# Altium project RpiPaw1.PrjPCB
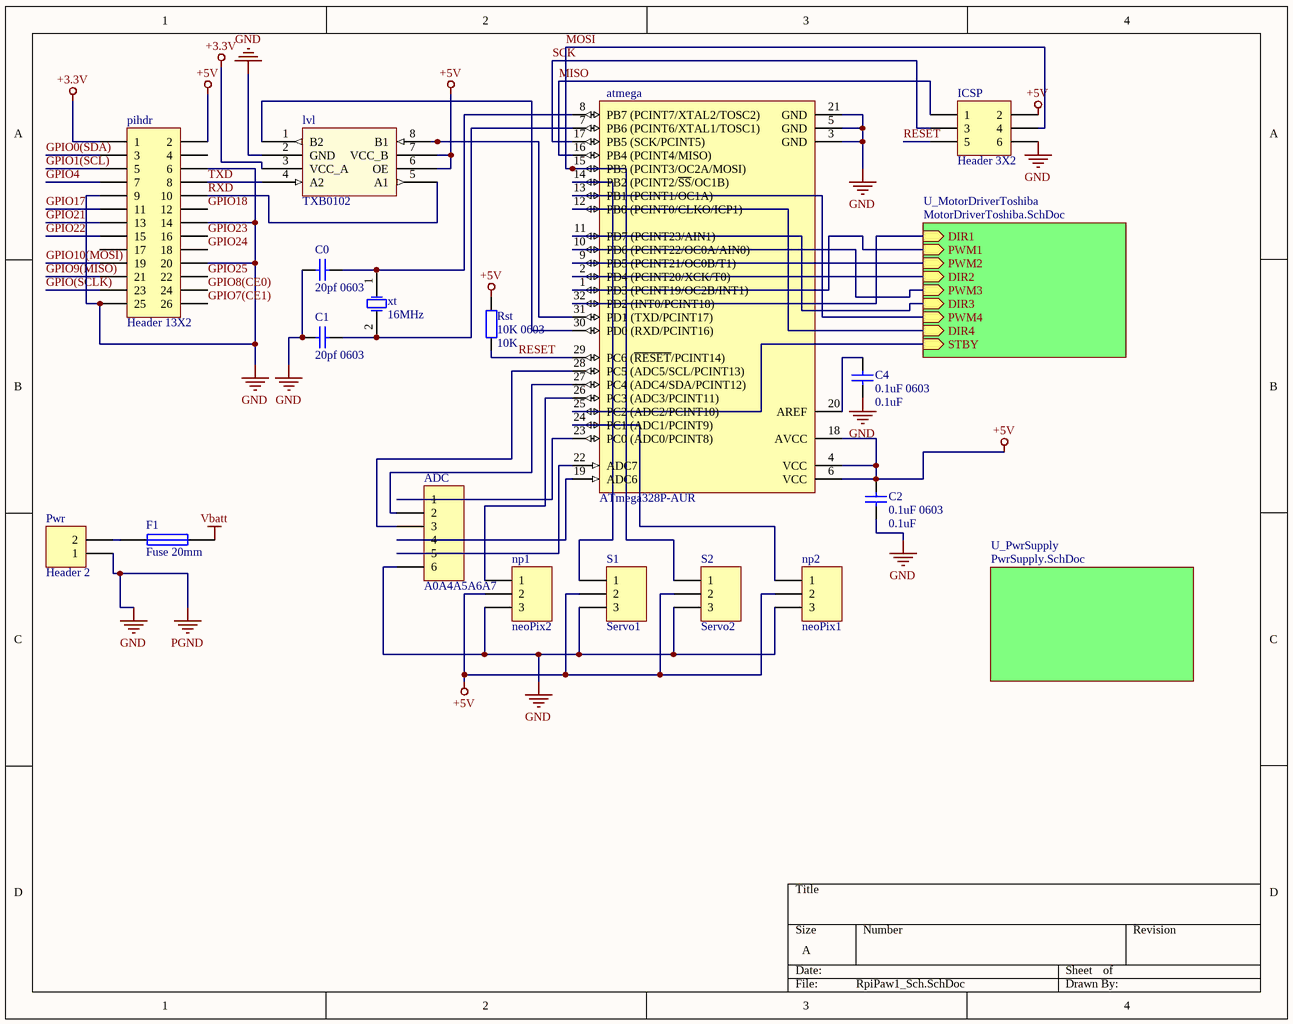
[diagram p0: RpiPaw1_Sch.SchDoc]
3 sheets, 39 parts. Net scope: hierarchical (ports join the sheet entries above them; power ports are global).
Board files: paw8.PcbDoc, Paw3.PcbDoc, Paw2.PcbDoc
Sheets:
  RpiPaw1_Sch.SchDoc
    U_MotorDriverToshiba = MotorDriverToshiba.SchDoc
    U_PwrSupply = PwrSupply.SchDoc

## Sheet RpiPaw1_Sch.SchDoc
size A

### Parts
ADC  A0A4A5A6A7  [HDR1X6]
atmega  ATmega328P-AUR  [TQFP32_N]
C0  20pf 0603  [J1-0603]
C1  20pf 0603  [J1-0603]
C2  0.1uF 0603  value 0.1uF  [J1-0603]
C4  0.1uF 0603  value 0.1uF  [J1-0603]
F1  Fuse 20mm  [FusePad1]
ICSP  Header 3X2  [HDR2X3]
lvl  TXB0102  [TSSOP50P310X90-8N]
np1  neoPix2  [HDR1X3]
np2  neoPix1  [HDR1X3]
pihdr  Header 13X2  [HDR2X13]
Pwr  Header 2  [PwrPlug1]
Rst  10K 0603  value 10K  [J1-0603]
S1  Servo1  [HDR1X3]
S2  Servo2  [HDR1X3]
xt  16MHz  [Axial 0.2]

### Sub-sheets
U_MotorDriverToshiba = MotorDriverToshiba.SchDoc: DIR1 (in), PWM1 (in), PWM2 (in), DIR2 (in), PWM3 (in), DIR3 (in), PWM4 (in), DIR4 (in), STBY (in)
U_PwrSupply = PwrSupply.SchDoc: no entries

### Nets
+3.3V: lvl.3(VCC_A) pihdr.1
+5V: atmega.4(VCC) atmega.6(VCC) atmega.18(AVCC) C2.2 ICSP.2 lvl.6(OE) lvl.7(VCC_B) np1.2 np2.2 pihdr.2 Rst.2 S1.2 S2.2
GND: ADC.6 atmega.3(GND) atmega.5(GND) atmega.21(GND) C0.1 C1.1 C2.1 C4.1 ICSP.6 lvl.2(GND) np1.3 np2.3 pihdr.6 pihdr.9 pihdr.14 pihdr.20 pihdr.25 Pwr.1 S1.3 S2.3  [also labelled PGND]
Vbatt: F1.2
GPIO0(SDA): pihdr.3
GPIO1(SCL): pihdr.5
GPIO4: pihdr.7
GPIO7(CE1): pihdr.26
GPIO8(CE0): pihdr.24
GPIO9(MISO): pihdr.21
GPIO10(MOSI): pihdr.19
GPIO17: pihdr.11
GPIO18: pihdr.12
GPIO21: pihdr.13
GPIO22: pihdr.15
GPIO23: pihdr.16
GPIO24: pihdr.18
GPIO25: pihdr.22
GPIO(SCLK): pihdr.23
MISO: atmega.16(PB4_(PCINT4/MISO)) ICSP.1
MOSI: atmega.15(PB3_(PCINT3/OC2A/MOSI)) ICSP.4 S2.1
RESET: atmega.29(PC6_(~{RESET}/PCINT14)) ICSP.5 Rst.1
RXD: lvl.5(A1) pihdr.10
SCK: atmega.17(PB5_(SCK/PCINT5)) ICSP.3
TXD: lvl.4(A2) pihdr.8
NetADC_1: ADC.1 atmega.23(PC0_(ADC0/PCINT8))
NetADC_2: ADC.2 atmega.27(PC4_(ADC4/SDA/PCINT12))
NetADC_3: ADC.3 atmega.28(PC5_(ADC5/SCL/PCINT13))
NetADC_4: ADC.4 atmega.19(ADC6)
NetADC_5: ADC.5 atmega.22(ADC7)
Netatmega_1: atmega.1(PD3_(PCINT19/OC2B/INT1)) ; sheet U_MotorDriverToshiba/PWM1
Netatmega_2: atmega.2(PD4_(PCINT20/XCK/T0)) ; sheet U_MotorDriverToshiba/DIR2
Netatmega_7: atmega.7(PB6_(PCINT6/XTAL1/TOSC1)) C1.2 xt.2(OSC2)
Netatmega_8: atmega.8(PB7_(PCINT7/XTAL2/TOSC2)) C0.2 xt.1(OSC1)
Netatmega_9: atmega.9(PD5_(PCINT21/OC0B/T1)) ; sheet U_MotorDriverToshiba/PWM2
Netatmega_10: atmega.10(PD6_(PCINT22/OC0A/AIN0)) ; sheet U_MotorDriverToshiba/PWM3
Netatmega_11: atmega.11(PD7_(PCINT23/AIN1)) ; sheet U_MotorDriverToshiba/DIR3
Netatmega_12: atmega.12(PB0_(PCINT0/CLKO/ICP1)) ; sheet U_MotorDriverToshiba/DIR4
Netatmega_13: atmega.13(PB1_(PCINT1/OC1A)) ; sheet U_MotorDriverToshiba/PWM4
Netatmega_14: atmega.14(PB2_(PCINT2/~{SS}/OC1B)) S1.1
Netatmega_20: atmega.20(AREF) C4.2
Netatmega_24: atmega.24(PC1_(ADC1/PCINT9)) np2.1
Netatmega_25: atmega.25(PC2_(ADC2/PCINT10)) ; sheet U_MotorDriverToshiba/STBY
Netatmega_26: atmega.26(PC3_(ADC3/PCINT11)) np1.1
Netatmega_30: atmega.30(PD0_(RXD/PCINT16)) lvl.1(B2)
Netatmega_31: atmega.31(PD1_(TXD/PCINT17)) lvl.8(B1)
Netatmega_32: atmega.32(PD2_(INT0/PCINT18)) ; sheet U_MotorDriverToshiba/DIR1
NetF1_1: F1.1 Pwr.2

Not connected (* = marked no-connect by the designer): pihdr 4 17

### Library data of the parts
ADC = Header 6: Header, 6-Pin; LatestRevisionDate: 17-Jul-2002; LatestRevisionNote: Re-released for DXP Platform.; Publisher: Altium Limited
atmega = ATmega328P-AUR: 8-bit AVR Microcontroller, 32KB Flash, 1KB EEPROM, 2KB SRAM, 32-pin TQFP, Industrial Grade (-40°C to 85°C); Published: 1-Apr-2010; DatasheetVersion: revA, Jan-2010; PackageVersion: revB, Oct-2001; PackageReference: 32A; Publisher: Altium Limited; PackageDescription: 32-Lead, 7x7x1.0 mm Body, 0.8mm Lead Pitch, Thin Profile Plastic Quad Flat Package (TQFP); Supplier 1: Digi-Key; Supplier Part Number 1: ATMEGA328P-AUR-ND; Supplier 2: Mouser; Supplier Part Number 2: 556-ATMEGA328P-AUR; Code_JEDEC: MS-026-ABA; ComponentLink1Description: Manufacturer Link; ComponentLink1URL: http://www.atmel.com/products/avr/default.asp?; ComponentLink2Description: ATmega48A/48PA/88A/88PA/168A/168PA/328/328P Datasheet; ComponentLink2URL: http://www.atmel.com/dyn/resources/prod_documents/8271.pdf; ComponentLink3Description: ATmega48A/48PA/88A/88PA/168A/168PA/328/328P Summary; ComponentLink3URL: http://www.atmel.com/dyn/resources/prod_documents/8271S.pdf; ComponentLink4Description: Atmel.com Home; ComponentLink4URL: http://www.atmel.com
C0-C2 C4 = Cap: Capacitor; Published: 8-Jun-2000; LatestRevisionDate: 17-Jul-2002; LatestRevisionNote: Re-released for DXP Platform.; PackageReference: RAD-0.3; Publisher: Altium Limited
F1 = Fuse 1: Fuse; Published: 8-Jun-2000; LatestRevisionDate: 17-Jul-2002; LatestRevisionNote: Re-released for DXP Platform.; PackageReference: PIN-W2/E2.8; Publisher: Altium Limited
ICSP = Header 3X2: Header, 3-Pin, Dual row; LatestRevisionDate: 17-Jul-2002; LatestRevisionNote: Re-released for DXP Platform.; Publisher: Altium Limited
lvl = TXB0102: 3.3V Level translator
np1 np2 S1 S2 = Header 3: Header, 3-Pin; LatestRevisionDate: 17-Jul-2002; LatestRevisionNote: Re-released for DXP Platform.; Publisher: Altium Limited
pihdr = Header 13X2: Header, 13-Pin, Dual row; LatestRevisionDate: 17-Jul-2002; LatestRevisionNote: Re-released for DXP Platform.; Publisher: Altium Limited
Pwr = Header 2: Header, 2-Pin; LatestRevisionDate: 17-Jul-2002; LatestRevisionNote: Re-released for DXP Platform.; Publisher: Altium Limited
Rst = Res2: Resistor; Published: 8-Jun-2000; LatestRevisionDate: 17-Jul-2002; LatestRevisionNote: Re-released for DXP Platform.; PackageReference: AXIAL-0.4; Publisher: Altium Limited
xt = XTAL: Crystal Oscillator; Published: 8-Jun-2000; LatestRevisionDate: 17-Jul-2002; LatestRevisionNote: Re-released for DXP Platform.; PackageReference: R38; Publisher: Altium Limited

## Sheet MotorDriverToshiba.SchDoc
size A
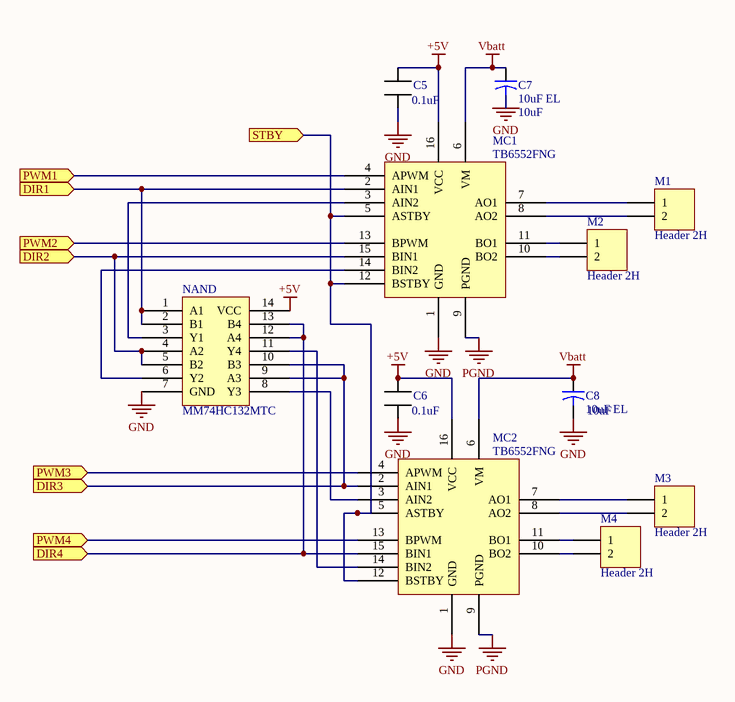
[diagram p1: MotorDriverToshiba.SchDoc]

### Parts
C5  value 0.1uF  [J1-0603]  (hidden comment: 0.1uF 0603)
C6  value 0.1uF  [J1-0603]  (hidden comment: 0.1uF 0603)
C7  10uF EL  value 10uF  [CAPR5-4X5]
C8  10uF EL  value 10uF  [CAPR5-4X5]
M1  Header 2H  [HDR1X2H]
M2  Header 2H  [HDR1X2H]
M3  Header 2H  [HDR1X2H]
M4  Header 2H  [HDR1X2H]
MC1  TB6552FNG  [SSOP16]
MC2  TB6552FNG  [SSOP16]
NAND  MM74HC132MTC  [TSSOP14]

### Ports
DIR1 (in), DIR2 (in), DIR3 (in), DIR4 (in), PWM1 (in), PWM2 (in), PWM3 (in), PWM4 (in), STBY (in)

### Nets
+5V: C5.2(P2) C6.2(P2) MC1.16(VCC) MC2.16(VCC) NAND.14(VCC)
GND: C5.1(P1) C6.1(P1) C7.2 C8.2 MC1.1(GND) MC1.9(PGND) MC2.1(GND) MC2.9(PGND) NAND.7(GND)  [also labelled PGND]
Vbatt: C7.1 C8.1 MC1.6(VM) MC2.6(VM)
Netatmega_1: MC1.4(APWM) ; port PWM1
Netatmega_2: MC1.15(BIN1) NAND.4(A2) NAND.5(B2) ; port DIR2
Netatmega_9: MC1.13(BPWM) ; port PWM2
Netatmega_10: MC2.4(APWM) ; port PWM3
Netatmega_11: MC2.2(AIN1) NAND.9(A3) NAND.10(B3) ; port DIR3
Netatmega_12: MC2.15(BIN1) NAND.12(A4) NAND.13(B4) ; port DIR4
Netatmega_13: MC2.13(BPWM) ; port PWM4
Netatmega_25: MC1.5(ASTBY) MC1.12(BSTBY) MC2.5(ASTBY) MC2.12(BSTBY) ; port STBY
Netatmega_32: MC1.2(AIN1) NAND.1(A1) NAND.2(B1) ; port DIR1
NetM1_1: M1.1 MC1.7(AO1)
NetM1_2: M1.2 MC1.8(AO2)
NetM2_1: M2.1 MC1.11(BO1)
NetM2_2: M2.2 MC1.10(BO2)
NetM3_1: M3.1 MC2.7(AO1)
NetM3_2: M3.2 MC2.8(AO2)
NetM4_1: M4.1 MC2.11(BO1)
NetM4_2: M4.2 MC2.10(BO2)
NetMC1_3: MC1.3(AIN2) NAND.3(Y1)
NetMC1_14: MC1.14(BIN2) NAND.6(Y2)
NetMC2_3: MC2.3(AIN2) NAND.8(Y3)
NetMC2_14: MC2.14(BIN2) NAND.11(Y4)

### Library data of the parts
C5 C6 = CAP: Capacitor
C7 C8 = Cap2: Capacitor; Published: 23-Sep-2002; PackageReference: CAPR5-4X5; Publisher: Altium Limited
M1-M4 = Header 2H: Header, 2-Pin, Right Angle; LatestRevisionDate: 17-Jul-2002; LatestRevisionNote: Re-released for DXP Platform.; Publisher: Altium Limited
MC1 MC2 = TB6552FNG: 2CH 1A PMIC
NAND = MM74HC132MTC: 4Ch NAND Gate

## Sheet PwrSupply.SchDoc
size A
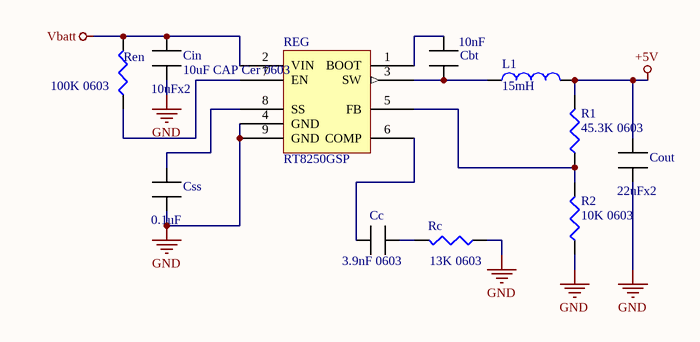
[diagram p2: PwrSupply.SchDoc]

### Parts
Cbt  value 10nF  [J1-0603]  (hidden comment: 10nF 0603)
Cc  3.9nF 0603  [J1-0603]
Cin  10uF CAP Cer 0603  value 10uFx2  [J1-0603]
Cout  value 22uFx2  [C0805]  (hidden comment: 22uF CAP CER 0805)
Css  value 0.1uF  [J1-0603]  (hidden comment: 0.1uF CAP CER 0603)
L1  value 15mH  [Inductor_Paw]
R1  45.3K 0603  [J1-0603]
R2  10K 0603  [J1-0603]
Rc  13K 0603  [J1-0603]
REG  RT8250GSP  [SOP-8-C_N]
Ren  100K 0603  [J1-0603]

### Nets
+5V: Cout.2(P2) L1.2 R1.2
GND: Cin.1(P1) Cout.1(P1) Css.1(P1) R2.1 Rc.1 REG.4(GND) REG.9(GND)
Vbatt: Cin.2(P2) REG.2(VIN) Ren.2
NetCbt_1: Cbt.1(P1) L1.1 REG.3(SW)
NetCbt_2: Cbt.2(P2) REG.1(BOOT)
NetCc_1: Cc.1(P1) REG.6(COMP)
NetCc_2: Cc.2(P2) Rc.2
NetCss_2: Css.2(P2) REG.8(SS)
NetR1_1: R1.1 R2.2 REG.5(FB)
NetREG_7: REG.7(EN) Ren.1

### Library data of the parts
Cbt Cc Cin Cout Css = CAP: Capacitor
  Cc: value: 3.9nF
L1 = Inductor: Code_IEC: 1005; Published: 8-Jun-2000; LatestRevisionDate: 17-Jul-2002; LatestRevisionNote: Re-released for DXP Platform.; PackageReference: 0402-A; Publisher: Altium Limited; Code_JEITA: 0402
R1 R2 Rc Ren = Res3: Resistor; Published: 8-Jun-2000; LatestRevisionDate: 04-Mar-2005; LatestRevisionNote: PCB Footprint replaced.; PackageReference: J1-0603; Publisher: Altium Limited
  R1: Value: 45.3K
  R2: Value: 10K
  Rc: Value: 13K
  Ren: Value: 100K
REG = RT8250GSP: 3A 5V Buck Regulator

## Nets that join several sheets
+5V: RpiPaw1_Sch (13 pins), MotorDriverToshiba (5 pins), PwrSupply (Cout.2 L1.2 R1.2)
GND: RpiPaw1_Sch (20 pins), MotorDriverToshiba (9 pins), PwrSupply (7 pins)
Vbatt: RpiPaw1_Sch (F1.2), MotorDriverToshiba (C7.1 C8.1 MC1.6 MC2.6), PwrSupply (Cin.2 REG.2 Ren.2)
Netatmega_1: RpiPaw1_Sch (atmega.1), MotorDriverToshiba (MC1.4)
Netatmega_2: RpiPaw1_Sch (atmega.2), MotorDriverToshiba (MC1.15 NAND.4 NAND.5)
Netatmega_9: RpiPaw1_Sch (atmega.9), MotorDriverToshiba (MC1.13)
Netatmega_10: RpiPaw1_Sch (atmega.10), MotorDriverToshiba (MC2.4)
Netatmega_11: RpiPaw1_Sch (atmega.11), MotorDriverToshiba (MC2.2 NAND.9 NAND.10)
Netatmega_12: RpiPaw1_Sch (atmega.12), MotorDriverToshiba (MC2.15 NAND.12 NAND.13)
Netatmega_13: RpiPaw1_Sch (atmega.13), MotorDriverToshiba (MC2.13)
Netatmega_25: RpiPaw1_Sch (atmega.25), MotorDriverToshiba (MC1.5 MC1.12 MC2.5 MC2.12)
Netatmega_32: RpiPaw1_Sch (atmega.32), MotorDriverToshiba (MC1.2 NAND.1 NAND.2)